# EAGLE schematic Nixie_clock (EAGLE 9.5.1)

## Sheet 1 of 2
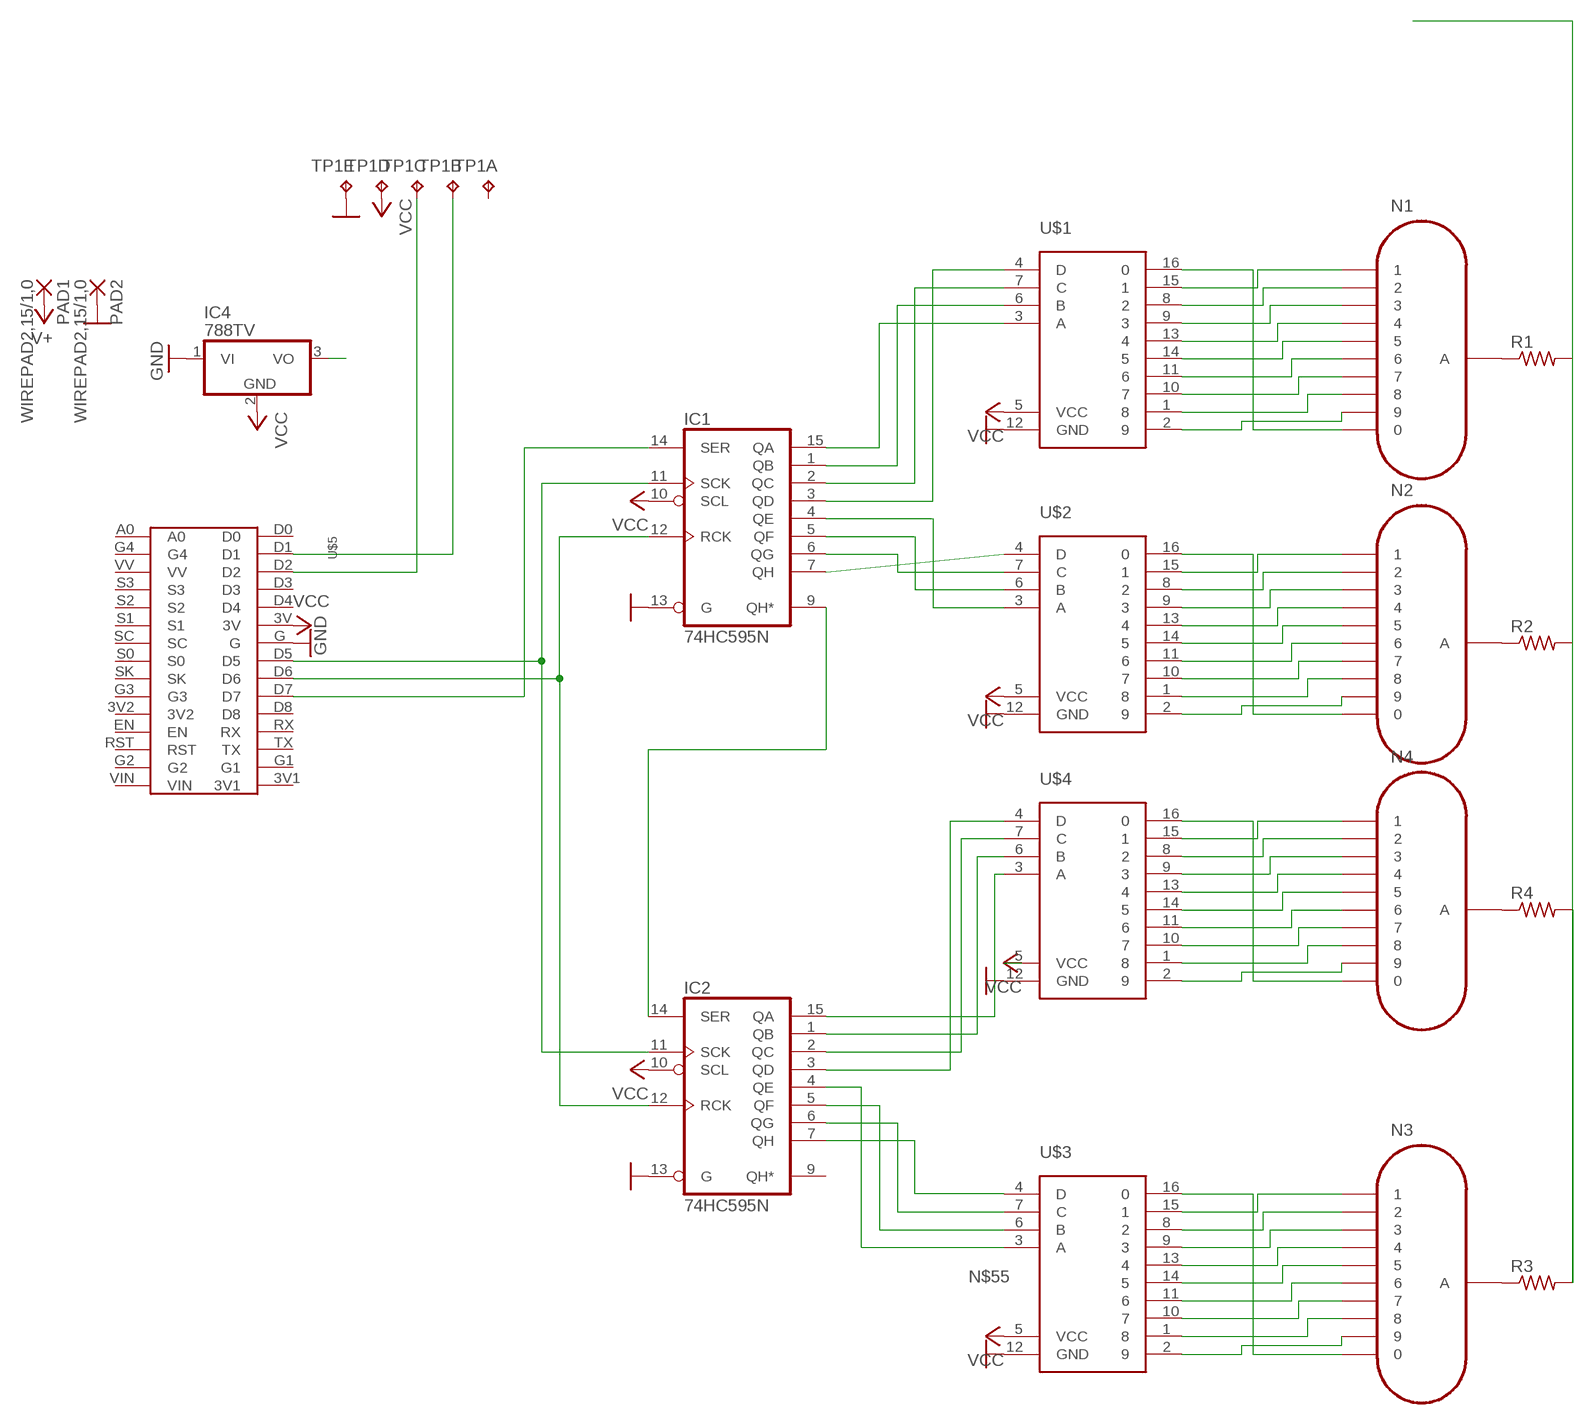
[diagram p0: schematic, sheet 1]

### Parts
IC1  74HC595N  [DIL16]
IC2  74HC595N  [DIL16]
IC4  788TV  [TO220V]
N1  IN-12A  [IN-12]
N2  IN-12A  [IN-12]
N3  IN-12A  [IN-12]
N4  IN-12A  [IN-12]
PAD1  WIREPAD2,15/1,0  [2,15/1,0]
PAD2  WIREPAD2,15/1,0  [2,15/1,0]
R1  R-US_0207/10  [0207/10]
R2  R-US_0207/10  [0207/10]
R3  R-US_0207/10  [0207/10]
R4  R-US_0207/10  [0207/10]
TP1  TP5P5-25-13  [P5-25-13]
U$1  K155ID1  [DIL16-KIT]
U$2  K155ID1  [DIL16-KIT]
U$3  K155ID1  [DIL16-KIT]
U$4  K155ID1  [DIL16-KIT]
U$5  LOLIN  [LOLIN]

### Nets
GND [New Class]: IC1.13(G) IC2.13(G) IC4.1(VI) PAD2.1(P) TP1.TP-5 U$1.12(GND) U$2.12(GND) U$3.12(GND) U$4.12(GND) U$5.G ; also sheet 2
N$1 [New Class]: N1.0 U$1.16
N$2 [New Class]: N1.1 U$1.15
N$3 [New Class]: N1.2 U$1.8
N$4 [New Class]: N1.3 U$1.9
N$5 [New Class]: N1.4 U$1.13
N$6 [New Class]: N1.5 U$1.14
N$7 [New Class]: N1.6 U$1.11
N$8 [New Class]: N1.7 U$1.10
N$9 [New Class]: N1.8 U$1.1
N$10 [New Class]: N1.9 U$1.2
N$11 [New Class]: N2.A R2.1
N$12 [New Class]: N2.0 U$2.16
N$13 [New Class]: N2.1 U$2.15
N$14 [New Class]: N2.2 U$2.8
N$15 [New Class]: N2.3 U$2.9
N$16 [New Class]: N2.4 U$2.13
N$17 [New Class]: N2.5 U$2.14
N$18 [New Class]: N2.6 U$2.11
N$19 [New Class]: N2.7 U$2.10
N$20 [New Class]: N2.8 U$2.1
N$21 [New Class]: N2.9 U$2.2
N$22 [New Class]: N3.A R3.1
N$23 [New Class]: N3.0 U$3.16
N$24 [New Class]: N3.1 U$3.15
N$25 [New Class]: N3.2 U$3.8
N$26 [New Class]: N3.3 U$3.9
N$27 [New Class]: N3.4 U$3.13
N$28 [New Class]: N3.5 U$3.14
N$29 [New Class]: N3.6 U$3.11
N$30 [New Class]: N3.7 U$3.10
N$31 [New Class]: N3.8 U$3.1
N$32 [New Class]: N3.9 U$3.2
N$33 [New Class]: N4.A R4.1
N$34 [New Class]: N4.0 U$4.16
N$35 [New Class]: N4.1 U$4.15
N$36 [New Class]: N4.2 U$4.8
N$37 [New Class]: N4.3 U$4.9
N$38 [New Class]: N4.4 U$4.13
N$39 [New Class]: N4.5 U$4.14
N$40 [New Class]: N4.6 U$4.11
N$41 [New Class]: IC1.1(QB) U$1.6(B)
N$42 [New Class]: IC1.15(QA) U$1.3(A)
N$43 [New Class]: IC1.4(QE) U$2.3(A)
N$44 [New Class]: IC1.3(QD) U$1.4(D)
N$45 [New Class]: IC1.5(QF) U$2.6(B)
N$46 [New Class]: IC1.6(QG) U$2.7(C)
N$47 [New Class]: IC1.7(QH) U$2.4(D)
N$48 [New Class]: IC2.15(QA) U$4.3(A)
N$49 [New Class]: N4.7 U$4.10
N$50 [New Class]: N4.8 U$4.1
N$51 [New Class]: IC2.1(QB) U$4.6(B)
N$52 [New Class]: IC2.2(QC) U$4.7(C)
N$53 [New Class]: IC2.3(QD) U$4.4(D)
N$54 [New Class]: IC2.4(QE) U$3.3(A)
N$55 [New Class]: IC2.5(QF) U$3.6(B)
N$56 [New Class]: IC2.6(QG) U$3.7(C)
N$57 [New Class]: N1.A R1.1
N$58 [New Class]: N4.9 U$4.2
N$59 [New Class]: IC2.7(QH) U$3.4(D)
N$60 [New Class]: TP1.TP-2 U$5.D1
N$61 [New Class]: IC1.11(SCK) IC2.11(SCK) U$5.D5
N$62 [New Class]: IC1.14(SER) U$5.D7
N$63 [New Class]: IC1.12(RCK) IC2.12(RCK) U$5.D6
N$64 [New Class]: IC1.2(QC) U$1.7(C)
N$65 [New Class]: TP1.TP-3 U$5.D2
N$66 [New Class]: R1.2 R2.2 R3.2 R4.2 ; also sheet 2
N$67: IC1.9(QH*) IC2.14(SER)
V+ [New Class]: IC4.3(VO) PAD1.1(P) ; also sheet 2
VCC [New Class]: IC1.10(SCL) IC2.10(SCL) IC4.2(GND) TP1.TP-4 U$1.5(VCC) U$2.5(VCC) U$3.5(VCC) U$4.5(VCC) U$5.3V
Unconnected: IC2.9(QH*) TP1.TP-1 U$5.3V1 U$5.3V2 U$5.A0 U$5.D0 U$5.D3 U$5.D4 U$5.D8 U$5.EN U$5.G1 U$5.G2 U$5.G3 U$5.G4 U$5.RST U$5.RX U$5.S0 U$5.S1 U$5.S2 U$5.S3 U$5.SC U$5.SK U$5.TX U$5.VIN U$5.VV

## Sheet 2 of 2
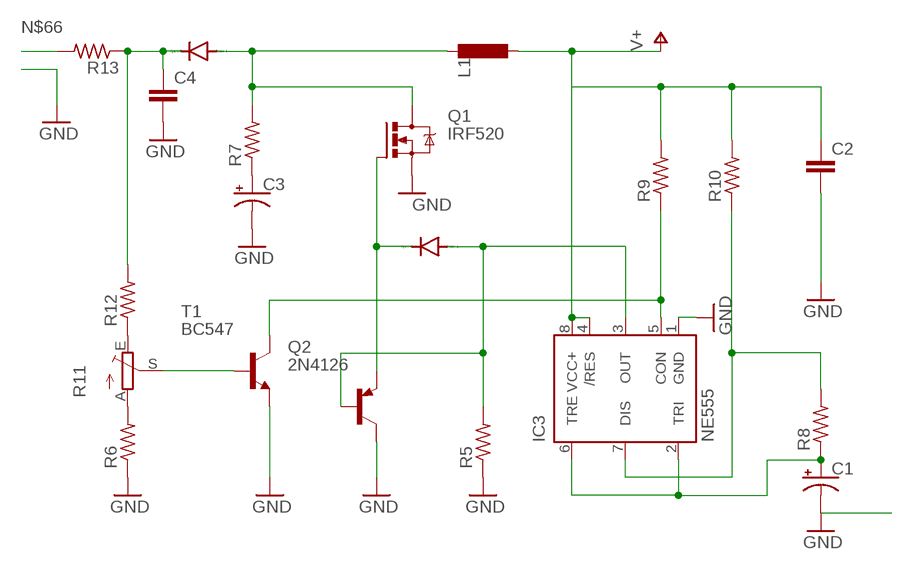
[diagram p1: schematic, sheet 2]

### Parts
C1  CPOL-USTAP5-80  [TAP5-80]
C2  C-EU025-025X050  [C025-025X050]
C3  CPOL-USTAP5-80  [TAP5-80]
C4  C-EU025-025X050  [C025-025X050]
D1  1N4004  [DO41-10]
D2  1N4004  [DO41-10]
IC3  NE555  [DIL-08]
L1  L-EU0204V  [0204V]
Q1  IRF520  [TO220BV]
Q2  2N4126  [TO92-CBE]
R5  R-US_0204/7  [0204/7]
R6  R-US_0204/7  [0204/7]
R7  R-US_0204/7  [0204/7]
R8  R-US_0204/7  [0204/7]
R9  R-US_0204/7  [0204/7]
R10  R-US_0204/7  [0204/7]
R11  TRIM_EU-S75H  [S75H]
R12  R-US_0204/7  [0204/7]
R13  R-US_0204/7  [0204/7]
T1  BC547  [TO92]

### Nets
GND [New Class]: C1.- C2.2 C3.- C4.2 IC3.1(GND) Q1.S Q2.C R5.1 R6.1 T1.1(E) ; also sheet 1
N$66 [New Class]: R13.2 ; also sheet 1
N$68 [New Class]: C1.+ IC3.2(TRI) IC3.6(TRE) R8.1
N$69 [New Class]: IC3.7(DIS) R8.2 R10.1
N$70 [New Class]: IC3.5(CON) R9.1 T1.3(C)
N$71 [New Class]: D1.A IC3.3(OUT) Q2.B R5.2
N$72 [New Class]: C3.+ R7.1
N$73 [New Class]: D1.C Q1.G Q2.E
N$74 [New Class]: R6.2 R11.A
N$75 [New Class]: R11.S T1.2(B)
N$76 [New Class]: R11.E R12.1
N$77 [New Class]: D2.A L1.1 Q1.D R7.2
N$78 [New Class]: C4.1 D2.C R12.2 R13.1
V+ [New Class]: C2.1 IC3.4(/RES) IC3.8(VCC+) L1.2 R9.2 R10.2 ; also sheet 1

## Power pins joined to a net without a drawn wire
GND: IC1.8(GND) IC2.8(GND)
VCC: IC1.16(VCC) IC2.16(VCC)

## Library data of the parts
C1 C3 = rcl:CPOL-US: POLARIZED CAPACITOR, American symbol; SPICEPREFIX: C
C2 C4 = rcl:C-EU: CAPACITOR, European symbol; SPICEPREFIX: C
D1 D2 = diode:1N4004: DIODE general purpose rectifier, 1 A
IC1 IC2 = 74xx-eu:74*595: 8-bit SHIFT REGISTER, output latch
IC3 = st-microelectronics:NE555: General purpose bipolar Timer; MF: Arrow Electronics; MPN: NE555N; OC_FARNELL: 1467742; OC_NEWARK: 89K1486
IC4 = linear:78*: Positive VOLTAGE REGULATOR Source: http://cache.national.com/ds/LM/LM78L05.pdf http://www.fairchildsemi.com/ds/LM/LM7805.pdf
L1 = rcl:L-EU: INDUCTOR, European symbol; SPICEPREFIX: L
N1-N4 = russian-nixies:IN-12A: IN-12A: medium numeric topview nixie tube
PAD1 PAD2 = wirepad:WIREPAD: Wire PAD connect wire on PCB
Q1 = transistor-power:IRF520: HEXFET Power MOSFET
Q2 = transistor-pnp:2N4126*: PNP Transistror
R1-R4 = adafruit:R-US_: RESISTOR, American symbol
R5-R10 R12 R13 = rcl:R-US_: RESISTOR, American symbol; SPICEPREFIX: R
R11 = pot:TRIM_EU-: POTENTIOMETER
T1 = transistor-neu-to92:BC547: NPN TRANSISTOR
TP1 = testpad:TP5: Test pad
U$1-U$4 = 74141:K155ID1
U$5 = Lolin:LOLIN

## Net classes
1 New Class: clearance 0.457 mm